# Altium schematic sheet [07] - CPU Clock JTAG UART.SchDoc
size A4
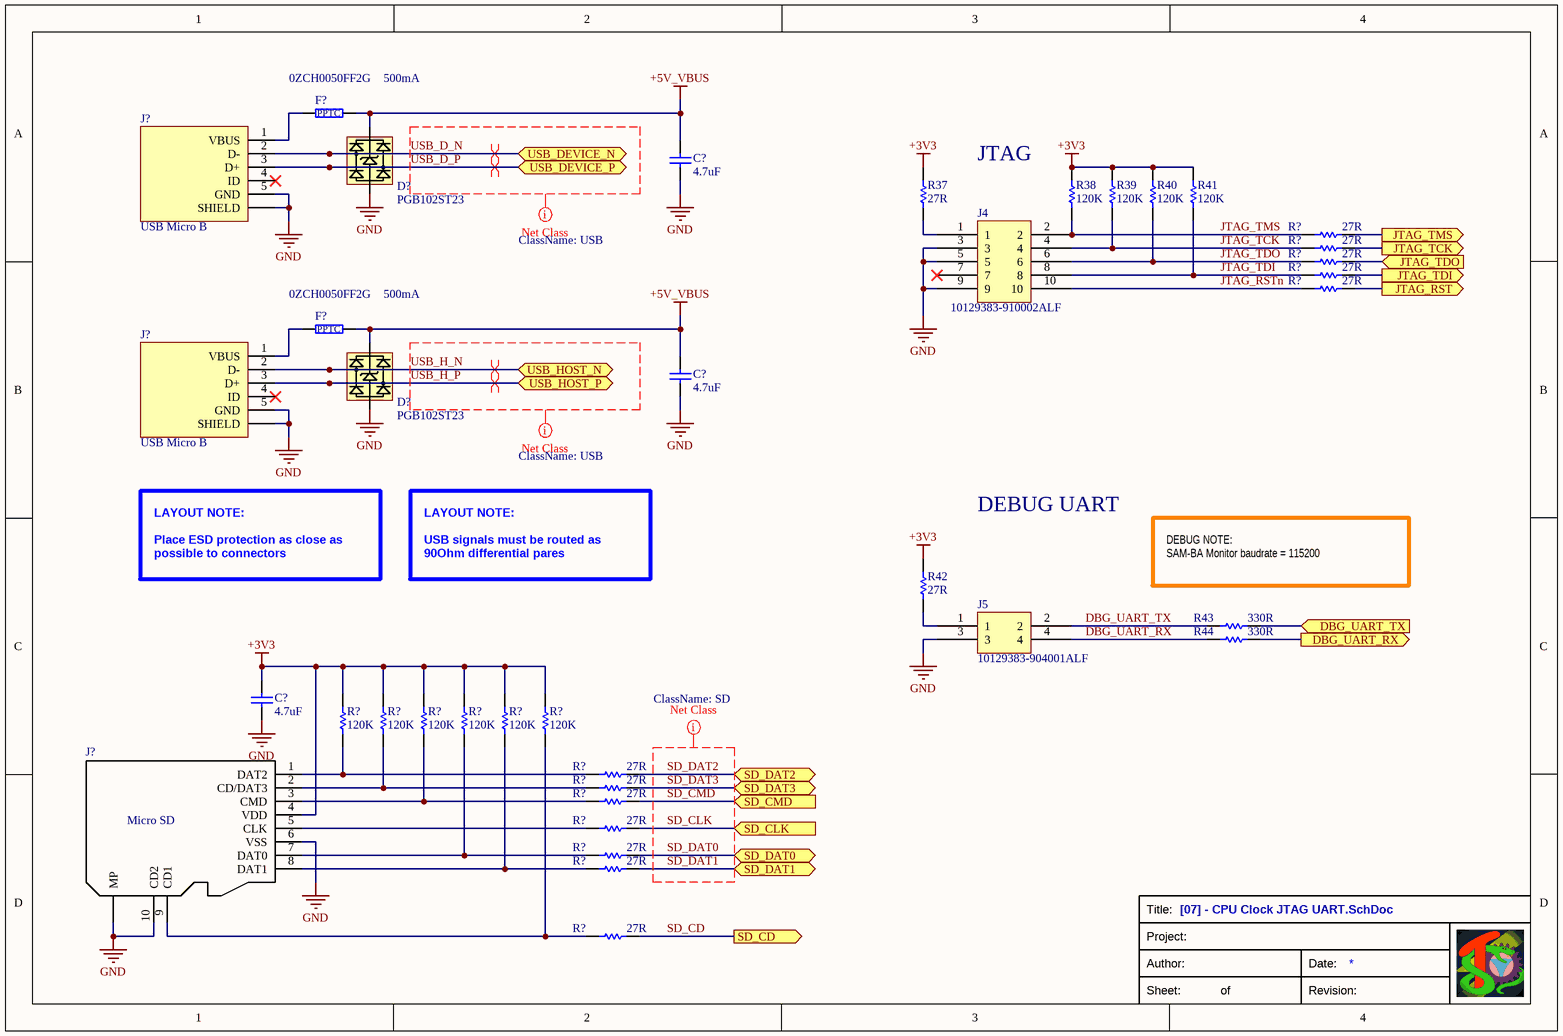
[diagram p0: [07] - CPU Clock JTAG UART.SchDoc]

## Parts
(Parts that share a designator on the sheet are numbered #1, #2 ... from top to bottom, then left to right.)
C?#1  value 4.7uF  [CAP-0805]  (hidden comment: 885012107013)
C?#2  value 4.7uF  [CAP-0805]  (hidden comment: 885012107013)
C?#3  value 4.7uF  [CAP-0805]  (hidden comment: 885012107013)
D?#1  PGB102ST23  [SOT23-5]
D?#2  PGB102ST23  [SOT23-5]
F?#1  0ZCH0050FF2G  value 500mA  [FUS-0ZCH-3x2.35]
F?#2  0ZCH0050FF2G  value 500mA  [FUS-0ZCH-3x2.35]
J4  10129383-910002ALF  [HEADER-5X2-2.54-SMD- 10129383]
J5  10129383-904001ALF  [HEADER-2X2-2.54-SMD- 10129383]
J?#1  USB Micro B  [UJ2-MIBH-G-SMT-TR]
J?#2  USB Micro B  [UJ2-MIBH-G-SMT-TR]
J?#3  Micro SD  [104031-0811]
R37  value 27R  [RES-0603]  (hidden comment: RT0603DRD0727RL)
R38  value 120K  [RES-0603]  (hidden comment: RT0603FRE07120KL)
R39  value 120K  [RES-0603]  (hidden comment: RT0603FRE07120KL)
R40  value 120K  [RES-0603]  (hidden comment: RT0603FRE07120KL)
R41  value 120K  [RES-0603]  (hidden comment: RT0603FRE07120KL)
R42  value 27R  [RES-0603]  (hidden comment: RT0603DRD0727RL)
R43  value 330R  [RES-0603]  (hidden comment: RT0603FRD07330RL)
R44  value 330R  [RES-0603]  (hidden comment: RT0603FRD07330RL)
R?#1  value 27R  [RES-0603]  (hidden comment: RT0603DRD0727RL)
R?#2  value 27R  [RES-0603]  (hidden comment: RT0603DRD0727RL)
R?#3  value 27R  [RES-0603]  (hidden comment: RT0603DRD0727RL)
R?#4  value 27R  [RES-0603]  (hidden comment: RT0603DRD0727RL)
R?#5  value 27R  [RES-0603]  (hidden comment: RT0603DRD0727RL)
R?#6  value 120K  [RES-0603]  (hidden comment: RT0603FRE07120KL)
R?#7  value 120K  [RES-0603]  (hidden comment: RT0603FRE07120KL)
R?#8  value 120K  [RES-0603]  (hidden comment: RT0603FRE07120KL)
R?#9  value 120K  [RES-0603]  (hidden comment: RT0603FRE07120KL)
R?#10  value 120K  [RES-0603]  (hidden comment: RT0603FRE07120KL)
R?#11  value 120K  [RES-0603]  (hidden comment: RT0603FRE07120KL)
R?#12  value 27R  [RES-0603]  (hidden comment: RT0603DRD0727RL)
R?#13  value 27R  [RES-0603]  (hidden comment: RT0603DRD0727RL)
R?#14  value 27R  [RES-0603]  (hidden comment: RT0603DRD0727RL)
R?#15  value 27R  [RES-0603]  (hidden comment: RT0603DRD0727RL)
R?#16  value 27R  [RES-0603]  (hidden comment: RT0603DRD0727RL)
R?#17  value 27R  [RES-0603]  (hidden comment: RT0603DRD0727RL)
R?#18  value 27R  [RES-0603]  (hidden comment: RT0603DRD0727RL)

## Ports
DBG_UART_RX (out), DBG_UART_TX (in), JTAG_RST (out), JTAG_TCK (out), JTAG_TDI (out), JTAG_TDO (in), JTAG_TMS (out), SD_CD (out), SD_CLK (in), SD_CMD (in), SD_DAT0 (bidir), SD_DAT1 (bidir), SD_DAT2 (bidir), SD_DAT3 (bidir), USB_DEVICE_N (bidir), USB_DEVICE_P (bidir), USB_HOST_N (bidir), USB_HOST_P (bidir)

## Nets
+3V3: C?#3.2 J?#3.4(VDD) R37.2 R38.2 R39.2 R40.2 R41.2 R42.2 R?#6.2 R?#7.2 R?#8.2 R?#9.2 R?#10.2 R?#11.2
+5V_VBUS: C?#1.2 C?#2.2 D?#1.5(Vp) D?#2.5(Vp) F?#1.2 F?#2.2
GND: C?#1.1 C?#2.1 C?#3.1 D?#1.2(Vn) D?#2.2(Vn) J4.3 J4.5 J4.9 J5.3 J?#1.5(GND) J?#1.SH(SHIELD) J?#2.5(GND) J?#2.SH(SHIELD) J?#3.6(VSS) J?#3.10(CD2) J?#3.MP
DBG_UART_RX: J5.4 R44.1
DBG_UART_RX: R44.2 ; port DBG_UART_RX  [a separate net that carries the same name]
DBG_UART_TX: J5.2 R43.1
DBG_UART_TX: R43.2 ; port DBG_UART_TX  [a separate net that carries the same name]
JTAG_RST: R?#5.2 ; port JTAG_RST
JTAG_RSTn: J4.10 R?#5.1
JTAG_TCK: J4.4 R39.1 R?#2.1
JTAG_TCK: R?#2.2 ; port JTAG_TCK  [a separate net that carries the same name]
JTAG_TDI: J4.8 R41.1 R?#4.1
JTAG_TDI: R?#4.2 ; port JTAG_TDI  [a separate net that carries the same name]
JTAG_TDO: J4.6 R40.1 R?#3.1
JTAG_TDO: R?#3.2 ; port JTAG_TDO  [a separate net that carries the same name]
JTAG_TMS: J4.2 R38.1 R?#1.1
JTAG_TMS: R?#1.2 ; port JTAG_TMS  [a separate net that carries the same name]
SD_CD: R?#18.2 ; port SD_CD
SD_CLK: R?#15.2 ; port SD_CLK
SD_CMD: R?#14.2 ; port SD_CMD
SD_DAT0: R?#16.2 ; port SD_DAT0
SD_DAT1: R?#17.2 ; port SD_DAT1
SD_DAT2: R?#12.2 ; port SD_DAT2
SD_DAT3: R?#13.2 ; port SD_DAT3
USB_D_N: D?#1.3(CH1) J?#1.2(D-) ; port USB_DEVICE_N
USB_D_P: D?#1.4(CH2) J?#1.3(D+) ; port USB_DEVICE_P
USB_H_N: D?#2.3(CH1) J?#2.2(D-) ; port USB_HOST_N
USB_H_P: D?#2.4(CH2) J?#2.3(D+) ; port USB_HOST_P
NetF?#1_1: F?#1.1 J?#1.1(VBUS)
NetF?#2_1: F?#2.1 J?#2.1(VBUS)
NetJ4_1: J4.1 R37.1
NetJ5_1: J5.1 R42.1
NetJ?#3_1: J?#3.1(DAT2) R?#6.1 R?#12.1
NetJ?#3_2: J?#3.2(CD/DAT3) R?#7.1 R?#13.1
NetJ?#3_3: J?#3.3(CMD) R?#8.1 R?#14.1
NetJ?#3_5: J?#3.5(CLK) R?#15.1
NetJ?#3_7: J?#3.7(DAT0) R?#9.1 R?#16.1
NetJ?#3_8: J?#3.8(DAT1) R?#10.1 R?#17.1
NetJ?#3_9: J?#3.9(CD1) R?#11.1 R?#18.1

Not connected (* = marked no-connect by the designer): J4 7*; J?#1 4(ID)*; J?#2 4(ID)*

## Layout directives
differential pair; differential pair class DIFF90: USB_D_N, USB_D_P, USB_H_N, USB_H_P
net class SD: SD_CLK, SD_CMD, SD_DAT0, SD_DAT1, SD_DAT2, SD_DAT3
net class USB: USB_D_N, USB_D_P, USB_H_N, USB_H_P

## Notes on the sheet
- JTAG
- DEBUG UART
- LAYOUT NOTE:
  Place ESD protection as close as possible to connectors
- LAYOUT NOTE:
  USB signals must be routed as 90Ohm differential pares
- DEBUG NOTE:
  SAM-BA Monitor baudrate = 115200
- Title:
- Project:
- Sheet:
- Author:
- of
- Revision:
- Date:
- (in symbol PPTC-500mA-16V-0ZCH0050FF2G) PPTC

## Library data of the parts
C?#1-C?#3 = CAP-0805-4.7u-885012107013_2: Multilayer Ceramic Capacitors MLCC - SMD/SMT WCAP-CSGP 4.7uF 0805 20% 16V MLCC; Manufacturer: Wurth Elektronik; Voltage Rating DC: 16 VDC; Supplier 1: Mouser; Supplier Part Number 1: 710-885012107013
D?#1 D?#2 = DIODE-TVS-PGB102ST23: ESD Suppressors / TVS Diodes 2 Ch TVS Diode Array 3.3V 6.0A 400mW; Supplier 1: Mouser; Supplier Part Number 1: 621-D1213A-02SM-7
F?#1 F?#2 = PPTC-500mA-16V-0ZCH0050FF2G: Resettable Fuses - PPTC Fuse; Manufacturer: Bel; Maximum Voltage: 16V; Supplier 1: Mouser; Supplier Part Number 1: 530-0ZCH0050FF2G
J4 = HEADER-5x2-2.54-SMD-10129383-910002ALF: Headers & Wire Housings ECONOSTIK HEADER DR VT SMT 2X5; Supplier 1: Mouser; Supplier Part Number 1: 649-1012938391002ALF
J5 = HEADER-2x2-2.54-SMD-10129383-904001ALF: Headers & Wire Housings ECONOSTIK HEADER DR VT SMT 2X2; Supplier 1: Mouser; Supplier Part Number 1: 649-1012938390401ALF
J?#1 J?#2 = UJ2-MIBH-G-SMT-TR: USB Connectors Micro B, USB 2.0, 1.8 A, Right Angle, Surface Mount (SMT), USB Receptacle; Supplier 1: Mouser; Supplier Part Number 1: 490-UJ2-MIBH-G-SMTTR
J?#3 = 104031-0811: Memory Card Connectors MICRO SD PUSH-PULL SMT 1.42MM HEIGHT; Supplier 1: Mouser; Supplier Part Number 1: 538-104031-0811
R37 R42 R?#1-R?#5 R?#12-R?#18 = RES-0603-27R-RT0603DRD0727RL: Thin Film Resistors - SMD 1/10W 27 ohm 1% 50ppm; Manufacturer: Yageo; Supplier 1: Mouser; Supplier Part Number 1: 603-RT0603DRD0727RL
R38-R41 R?#6-R?#11 = RES-0603-120K-RT0603FRE07120KL: Thin Film Resistors - SMD 1/10W 120K ohm 1% 50ppm; Manufacturer: Yageo; Supplier 1: Mouser; Supplier Part Number 1: 603-RT0603FRE07120KL
R43 R44 = RES-0603-330R-RT0603FRD07330RL: Thin Film Resistors - SMD 1/10W 330 ohm 1% 50ppm; Manufacturer: Yageo; Supplier 1: Mouser; Supplier Part Number 1: 603-RT0603FRD07330RL